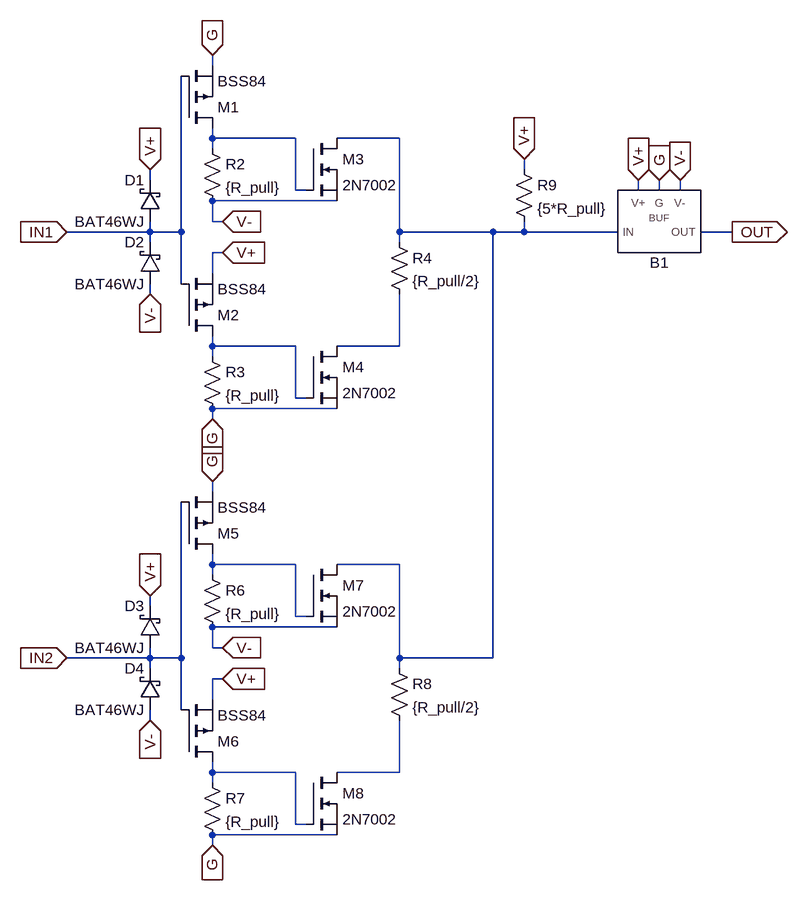
[diagram p0: schematic tri_min1.asc]
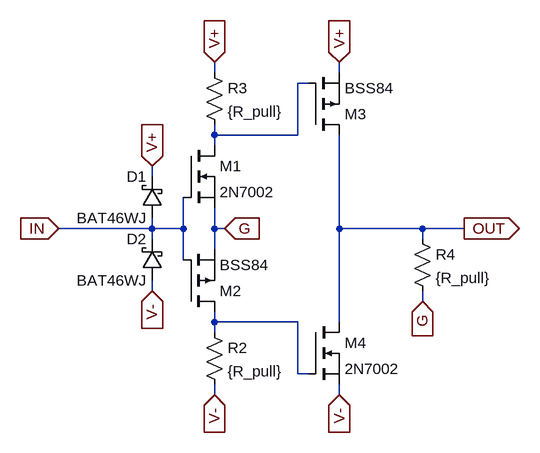
[diagram p1: sub-circuit tri_buffer1.asc]
tri_min1.asc, the LTspice schematic file:
Version 4
SHEET 1 988 1244
WIRE -32 -48 -32 -64
WIRE -32 64 -32 48
WIRE 96 64 -32 64
WIRE 256 64 160 64
WIRE -32 80 -32 64
WIRE 448 112 448 96
WIRE -128 128 -128 112
WIRE 96 144 96 64
WIRE 112 144 96 144
WIRE 624 144 624 128
WIRE 656 144 656 128
WIRE 688 144 688 128
WIRE 160 160 -32 160
WIRE -32 192 -32 160
WIRE -16 192 -32 192
WIRE -128 208 -128 192
WIRE -128 208 -256 208
WIRE -80 208 -80 -32
WIRE -80 208 -128 208
WIRE 256 208 256 64
WIRE 400 208 256 208
WIRE 448 208 448 192
WIRE 448 208 400 208
WIRE 592 208 448 208
WIRE 768 208 720 208
WIRE -128 224 -128 208
WIRE 256 224 256 208
WIRE -16 240 -32 240
WIRE -32 272 -32 240
WIRE -80 288 -80 208
WIRE -128 304 -128 288
WIRE -32 384 -32 368
WIRE 96 384 -32 384
WIRE 256 384 256 304
WIRE 256 384 160 384
WIRE -32 400 -32 384
WIRE 96 464 96 384
WIRE 112 464 96 464
WIRE 160 480 -32 480
WIRE -32 496 -32 480
WIRE -32 608 -32 592
WIRE -32 720 -32 704
WIRE 96 720 -32 720
WIRE 256 720 160 720
WIRE -32 736 -32 720
WIRE -128 784 -128 768
WIRE 96 800 96 720
WIRE 112 800 96 800
WIRE 160 816 -32 816
WIRE -32 848 -32 816
WIRE -16 848 -32 848
WIRE -128 864 -128 848
WIRE -128 864 -256 864
WIRE -80 864 -80 624
WIRE -80 864 -128 864
WIRE 256 864 256 720
WIRE 400 864 400 208
WIRE 400 864 256 864
WIRE -128 880 -128 864
WIRE 256 880 256 864
WIRE -16 896 -32 896
WIRE -32 928 -32 896
WIRE -80 944 -80 864
WIRE -128 960 -128 944
WIRE -32 1040 -32 1024
WIRE 96 1040 -32 1040
WIRE 256 1040 256 960
WIRE 256 1040 160 1040
WIRE -32 1056 -32 1040
WIRE 96 1120 96 1040
WIRE 112 1120 96 1120
WIRE 160 1136 -32 1136
WIRE -32 1152 -32 1136
FLAG -32 496 G
IOPIN -32 496 In
FLAG -256 208 IN1
IOPIN -256 208 In
FLAG 768 208 OUT
IOPIN 768 208 Out
FLAG -256 864 IN2
IOPIN -256 864 In
FLAG -128 112 V+
IOPIN -128 112 In
FLAG -16 240 V+
IOPIN -16 240 In
FLAG 624 128 V+
IOPIN 624 128 In
FLAG -128 768 V+
IOPIN -128 768 In
FLAG -16 896 V+
IOPIN -16 896 In
FLAG -128 304 V-
IOPIN -128 304 In
FLAG -16 192 V-
IOPIN -16 192 In
FLAG 688 128 V-
IOPIN 688 128 In
FLAG -128 960 V-
IOPIN -128 960 In
FLAG -16 848 V-
IOPIN -16 848 In
FLAG -32 592 G
IOPIN -32 592 In
FLAG -32 1152 G
IOPIN -32 1152 In
FLAG 448 96 V+
IOPIN 448 96 In
FLAG -32 -64 G
IOPIN -32 -64 In
FLAG 656 128 G
IOPIN 656 128 In
SYMBOL nmos 112 64 R0
SYMATTR InstName M3
SYMATTR Value 2N7002
SYMBOL schottky -112 192 R180
WINDOW 0 24 64 Left 2
WINDOW 3 24 0 Left 2
SYMATTR InstName D1
SYMATTR Value BAT46WJ
SYMATTR Description Diode
SYMATTR Type diode
SYMBOL schottky -112 288 R180
WINDOW 0 24 64 Left 2
WINDOW 3 24 0 Left 2
SYMATTR InstName D2
SYMATTR Value BAT46WJ
SYMATTR Description Diode
SYMATTR Type diode
SYMBOL pmos -80 48 M180
SYMATTR InstName M1
SYMATTR Value BSS84
SYMBOL res 240 208 R0
SYMATTR InstName R4
SYMATTR Value {R_pull/2}
SYMBOL schottky -112 848 R180
WINDOW 0 24 64 Left 2
WINDOW 3 24 0 Left 2
SYMATTR InstName D3
SYMATTR Value BAT46WJ
SYMATTR Description Diode
SYMATTR Type diode
SYMBOL schottky -112 944 R180
WINDOW 0 24 64 Left 2
WINDOW 3 24 0 Left 2
SYMATTR InstName D4
SYMATTR Value BAT46WJ
SYMATTR Description Diode
SYMATTR Type diode
SYMBOL tri_buffer1 656 208 R0
SYMATTR InstName B1
SYMBOL res -48 64 R0
SYMATTR InstName R2
SYMATTR Value {R_pull}
SYMBOL pmos -80 368 M180
SYMATTR InstName M2
SYMATTR Value BSS84
SYMBOL res -48 384 R0
SYMATTR InstName R3
SYMATTR Value {R_pull}
SYMBOL nmos 112 384 R0
SYMATTR InstName M4
SYMATTR Value 2N7002
SYMBOL nmos 112 720 R0
SYMATTR InstName M7
SYMATTR Value 2N7002
SYMBOL pmos -80 704 M180
SYMATTR InstName M5
SYMATTR Value BSS84
SYMBOL res 240 864 R0
SYMATTR InstName R8
SYMATTR Value {R_pull/2}
SYMBOL res -48 720 R0
SYMATTR InstName R6
SYMATTR Value {R_pull}
SYMBOL pmos -80 1024 M180
SYMATTR InstName M6
SYMATTR Value BSS84
SYMBOL res -48 1040 R0
SYMATTR InstName R7
SYMATTR Value {R_pull}
SYMBOL nmos 112 1040 R0
SYMATTR InstName M8
SYMATTR Value 2N7002
SYMBOL res 432 96 R0
SYMATTR InstName R9
SYMATTR Value {5*R_pull}

tri_buffer1.asc, the sub-circuit schematic file:
Version 4
SHEET 1 880 680
WIRE 32 -32 32 -48
WIRE 224 -32 224 -48
WIRE 176 -16 160 -16
WIRE 32 64 32 48
WIRE 160 64 160 -16
WIRE 160 64 32 64
WIRE 32 80 32 64
WIRE -64 128 -64 112
WIRE -64 208 -64 192
WIRE -64 208 -208 208
WIRE -16 208 -16 160
WIRE -16 208 -64 208
WIRE 32 208 32 176
WIRE 48 208 32 208
WIRE 224 208 224 64
WIRE 352 208 224 208
WIRE 416 208 352 208
WIRE -64 224 -64 208
WIRE 352 224 352 208
WIRE 32 240 32 208
WIRE -16 256 -16 208
WIRE -64 304 -64 288
WIRE 352 320 352 304
WIRE 32 352 32 336
WIRE 160 352 32 352
WIRE 224 352 224 208
WIRE 32 368 32 352
WIRE 160 432 160 352
WIRE 176 432 160 432
WIRE 32 464 32 448
WIRE 224 464 224 448
FLAG 224 -48 V+
IOPIN 224 -48 In
FLAG -64 304 V-
IOPIN -64 304 In
FLAG 352 320 G
IOPIN 352 320 In
FLAG -208 208 IN
IOPIN -208 208 In
FLAG 416 208 OUT
IOPIN 416 208 Out
FLAG 32 -48 V+
IOPIN 32 -48 In
FLAG -64 112 V+
IOPIN -64 112 In
FLAG 32 464 V-
IOPIN 32 464 In
FLAG 224 464 V-
IOPIN 224 464 In
FLAG 48 208 G
IOPIN 48 208 In
SYMBOL nmos -16 80 R0
SYMATTR InstName M1
SYMATTR Value 2N7002
SYMBOL pmos -16 336 M180
SYMATTR InstName M2
SYMATTR Value BSS84
SYMBOL schottky -48 192 R180
WINDOW 0 24 64 Left 2
WINDOW 3 24 0 Left 2
SYMATTR InstName D1
SYMATTR Value BAT46WJ
SYMATTR Description Diode
SYMATTR Type diode
SYMBOL schottky -48 288 R180
WINDOW 0 24 64 Left 2
WINDOW 3 24 0 Left 2
SYMATTR InstName D2
SYMATTR Value BAT46WJ
SYMATTR Description Diode
SYMATTR Type diode
SYMBOL res 16 352 R0
SYMATTR InstName R2
SYMATTR Value {R_pull}
SYMBOL res 16 -48 R0
SYMATTR InstName R3
SYMATTR Value {R_pull}
SYMBOL pmos 176 64 M180
SYMATTR InstName M3
SYMATTR Value BSS84
SYMBOL nmos 176 352 R0
SYMATTR InstName M4
SYMATTR Value 2N7002
SYMBOL res 336 208 R0
SYMATTR InstName R4
SYMATTR Value {R_pull}

The netlist it stands for:
* tri_min1.asc
M3 N002 N001 V- V- 2N7002
D1 IN1 V+ BAT46WJ
D2 V- IN1 BAT46WJ
M1 N001 IN1 G G BSS84
R4 N002 N004 {R_pull/2}
D3 IN2 V+ BAT46WJ
D4 V- IN2 BAT46WJ
XB1 V+ V- N002 OUT G tri_buffer1
R2 N001 V- {R_pull}
M2 N003 IN1 V+ V+ BSS84
R3 N003 G {R_pull}
M4 N004 N003 G G 2N7002
M7 N002 N005 V- V- 2N7002
M5 N005 IN2 G G BSS84
R8 N002 N007 {R_pull/2}
R6 N005 V- {R_pull}
M6 N006 IN2 V+ V+ BSS84
R7 N006 G {R_pull}
M8 N007 N006 G G 2N7002
R9 V+ N002 {5*R_pull}

* block symbol definitions
.subckt tri_buffer1 V+ V- IN OUT G
M1 N001 IN G G 2N7002
M2 N002 IN G G BSS84
D1 IN V+ BAT46WJ
D2 V- IN BAT46WJ
R2 N002 V- {R_pull}
R3 V+ N001 {R_pull}
M3 OUT N001 V+ V+ BSS84
M4 OUT N002 V- V- 2N7002
R4 OUT G {R_pull}
.ends tri_buffer1

.model D D
.lib standard.dio
.model NMOS NMOS
.model PMOS PMOS
.lib standard.mos
.backanno
.end